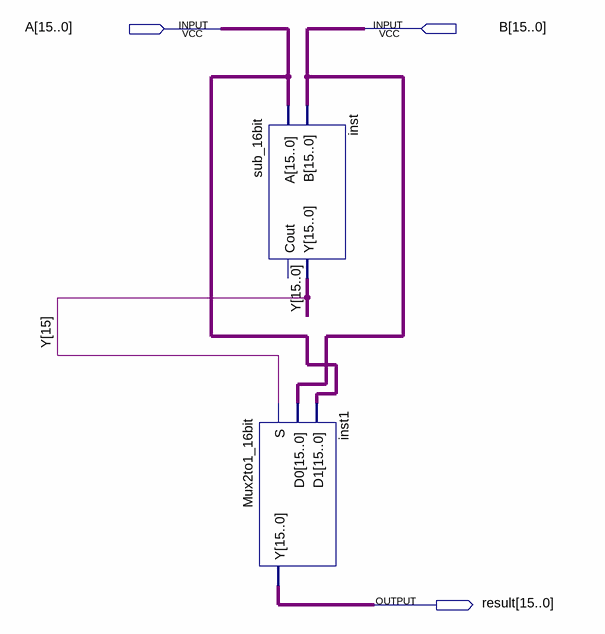
[diagram p0: schematic sheet]
// Quartus schematic MIN.bdf as structural Verilog: 2 symbols, 3 pins
module MIN (
  input  [15:0] A,
  input  [15:0] B,
  output [15:0] result
);

  wire [15:0] Y;

  sub_16bit inst (.A(A), .B(B), .Y(Y));  // open: Cout
  Mux2to1_16bit inst1 (.S(Y[15]), .D0(B), .D1(A), .Y(result));
endmodule
